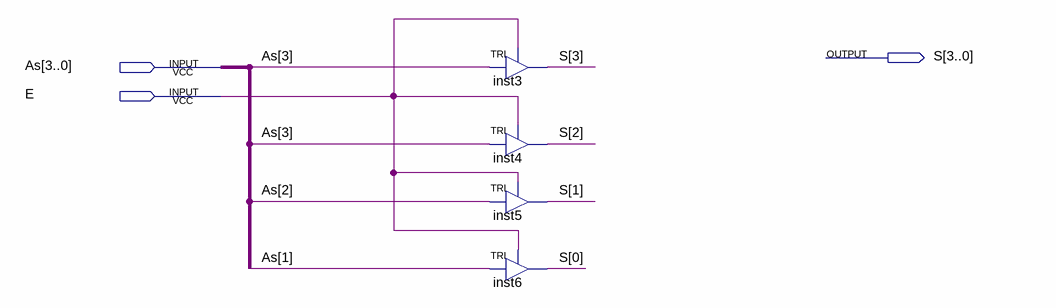
[diagram p0: schematic sheet]
// Quartus schematic Asr4bits.bdf as structural Verilog: 4 symbols, 3 pins
module Asr4bits (
  input  [3:0] As,
  input  E,
  output [3:0] S
);

  TRI inst3 (.IN(As[3]), .OE(E), .OUT(S[3]));
  TRI inst4 (.IN(As[3]), .OE(E), .OUT(S[2]));
  TRI inst5 (.IN(As[2]), .OE(E), .OUT(S[1]));
  TRI inst6 (.IN(As[1]), .OE(E), .OUT(S[0]));
endmodule
